# EasyEDA schematic schematic.json
TITLE: Sheet_1; REV: 1.0; Date: 2024-07-15; Sheet: 1/1; Drawn By: anoushkabh; Company: Your Company
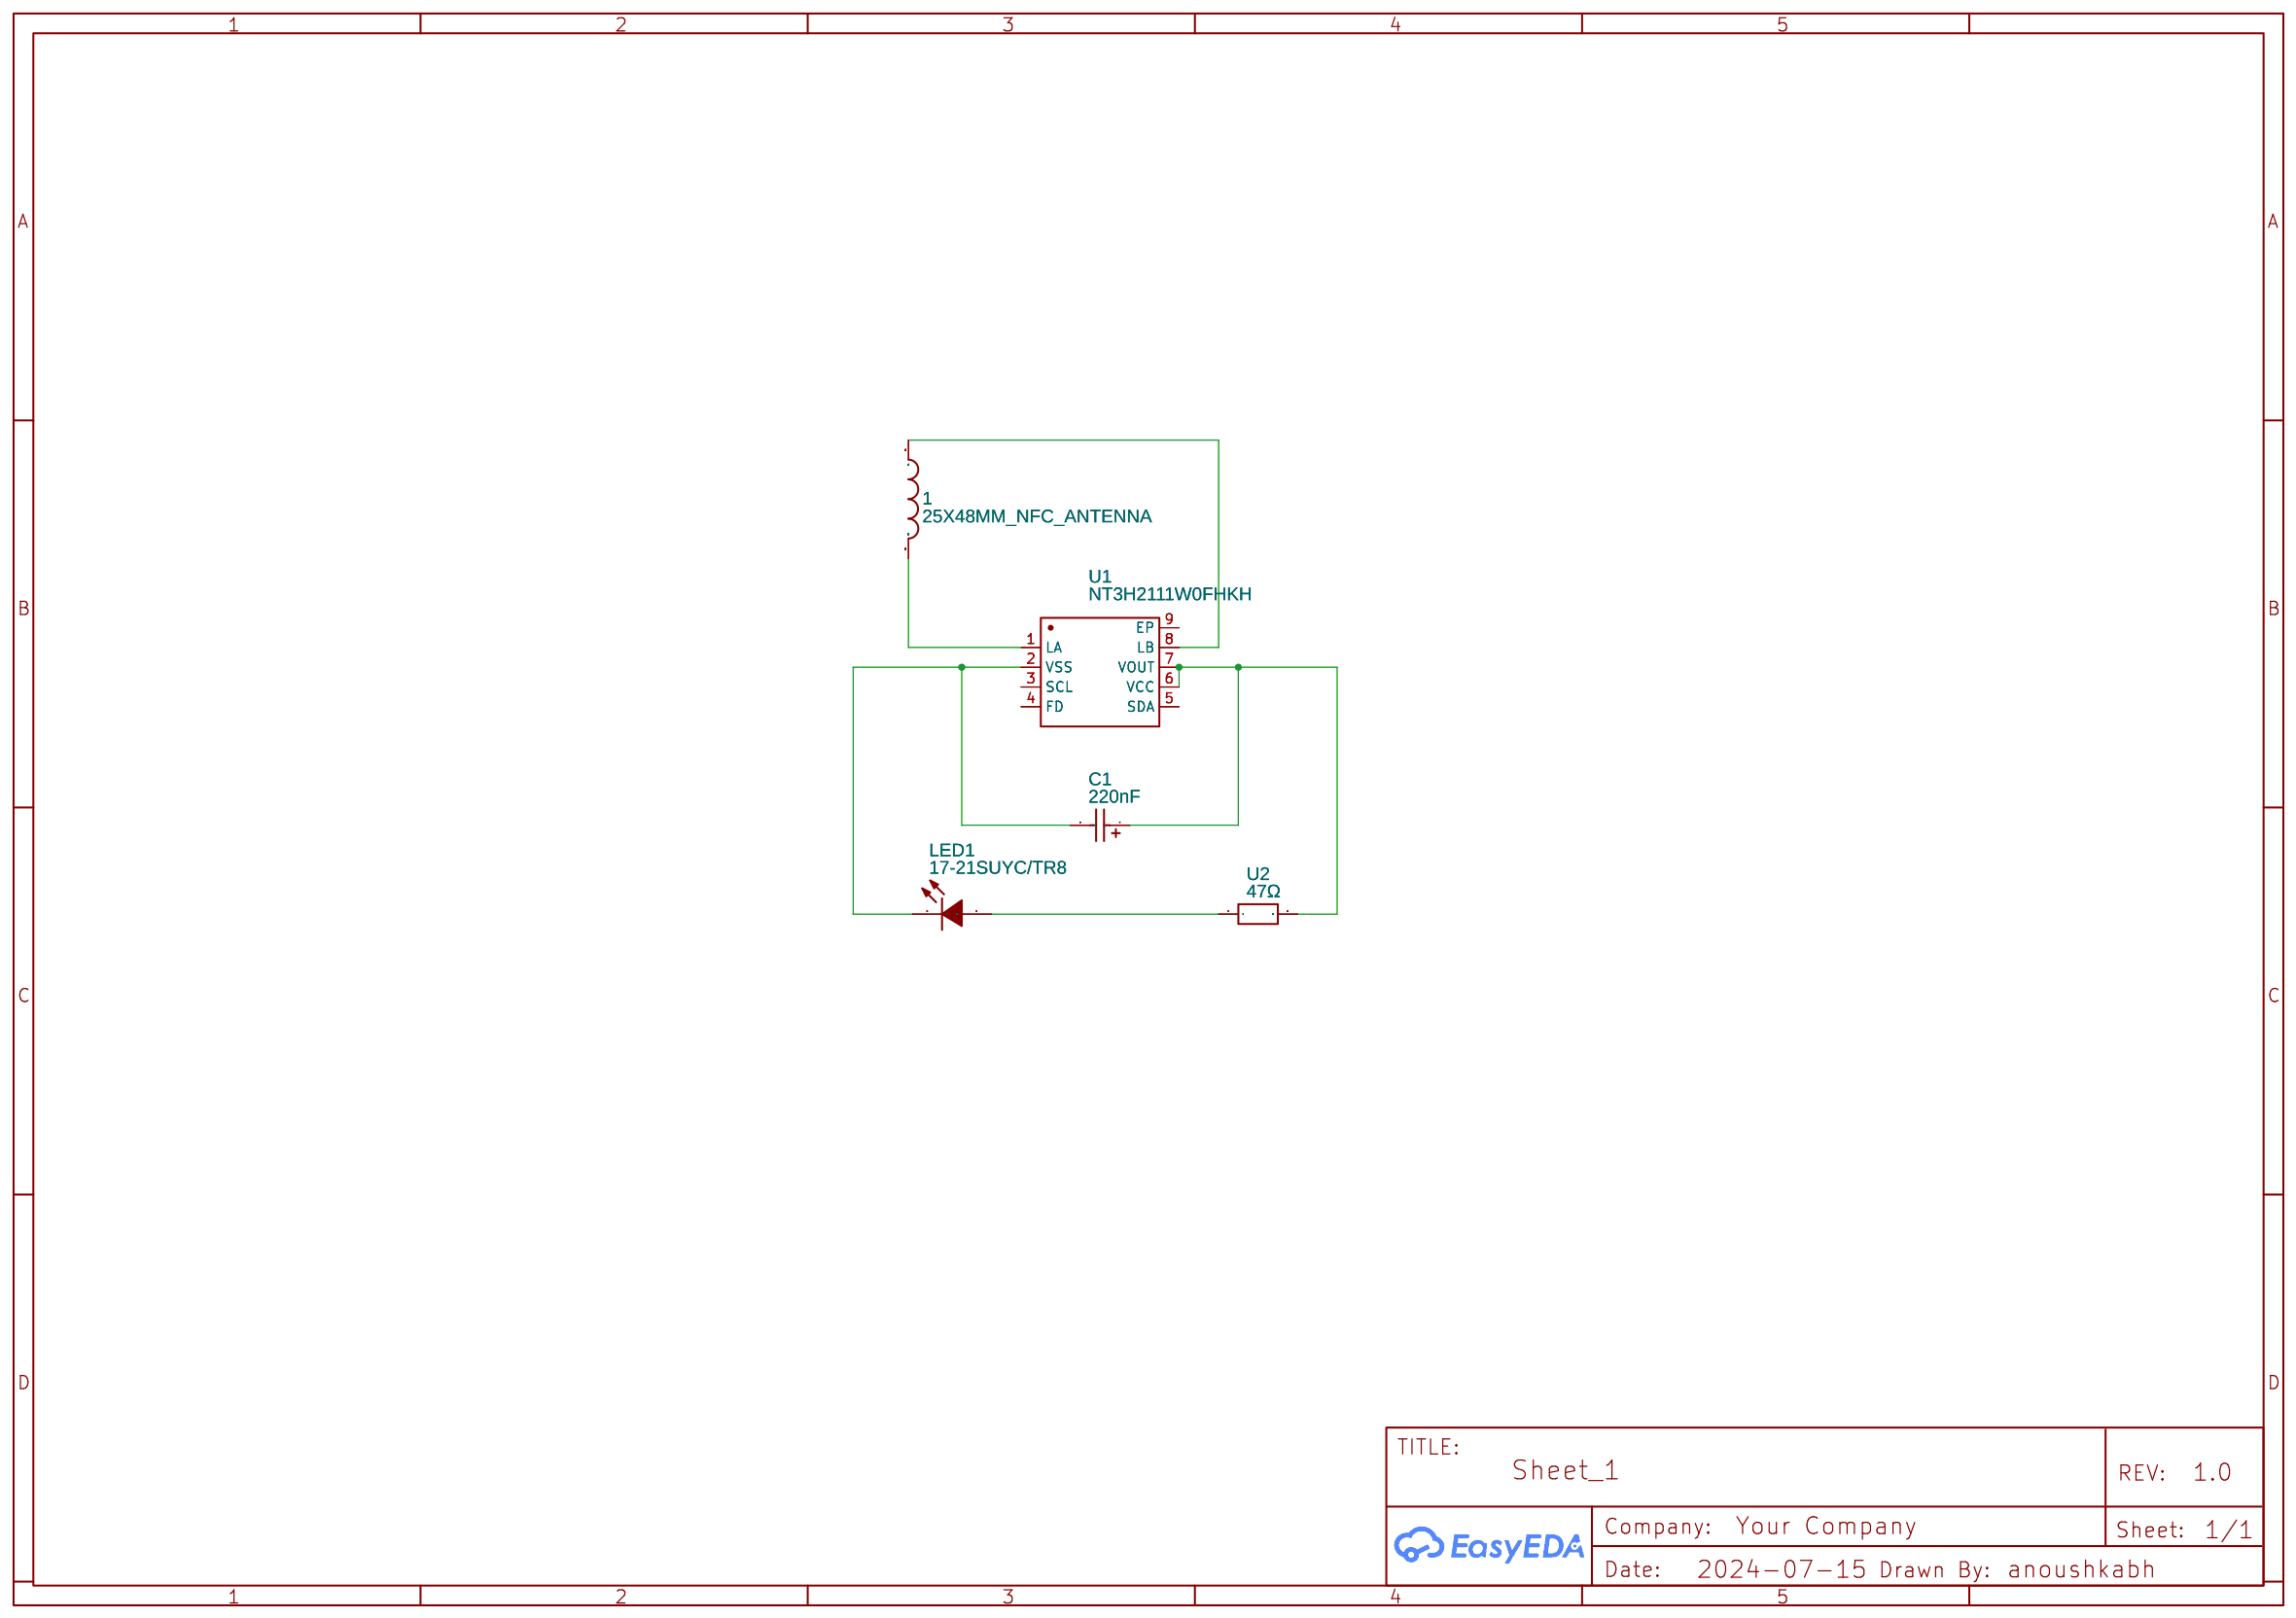
[diagram p0: schematic sheet]

## Parts
1  25X48MM_NFC_ANTENNA  [25X48MM_NFC_ANTENNA]
C1  220nF  [CASE-A_3216]
LED1  17-21SUYC/TR8  [LED0805-R-RD]
U1  NT3H2111W0FHKH  [XQFN-8_L1.6-W1.6-P0.50-BL]
U2  47Ω  [RES-TH_BD3.5-L9.0-P13.00-D0.5]

## Library data of the parts
1 = 25X48MM_NFC_ANTENNA: Contributor: dnonoo
C1 = TAJA224K035RNJ: Supplier: LCSC; Manufacturer: Kyocera AVX; Supplier Part: C11364; JLCPCB Part Class: Extended Part
LED1 = 17-21SUYC/TR8: Supplier: LCSC; Manufacturer: KENTO; Manufacturer Part: KT-0805黄灯; Supplier Part: C2296; JLCPCB Part Class: Basic Part
U1 = NT3H2111W0FHKH: Contributor: LCSC; Supplier: LCSC; Supplier Part: C710403; Manufacturer: NXP(恩智浦); JLCPCB Part Class: Extended Part
U2 = KNP1WS-47Ω±5%-XT52: Contributor: LCSC; Supplier: LCSC; Supplier Part: C601813; Manufacturer: VO(翔胜); JLCPCB Part Class: Extended Part

## Nets
Net-(1-P$1): 1.P$1 U1.8(LB)
Net-(1-P$2): 1.P$2 U1.1(LA)
Net-(C1-1): C1.1 U1.6(VCC) U1.7(VOUT) U2.2
Net-(C1-2): C1.2 LED1.2(-) U1.2(VSS)
Net-(LED1-1): LED1.1(+) U2.1

Not connected (* = marked no-connect by the designer): U1 3(SCL) 4(FD) 5(SDA) 9(EP)
